# Altium schematic sheet PIC32MZ.SchDoc
size B; SheetNumber: 2; SheetTotal: 6
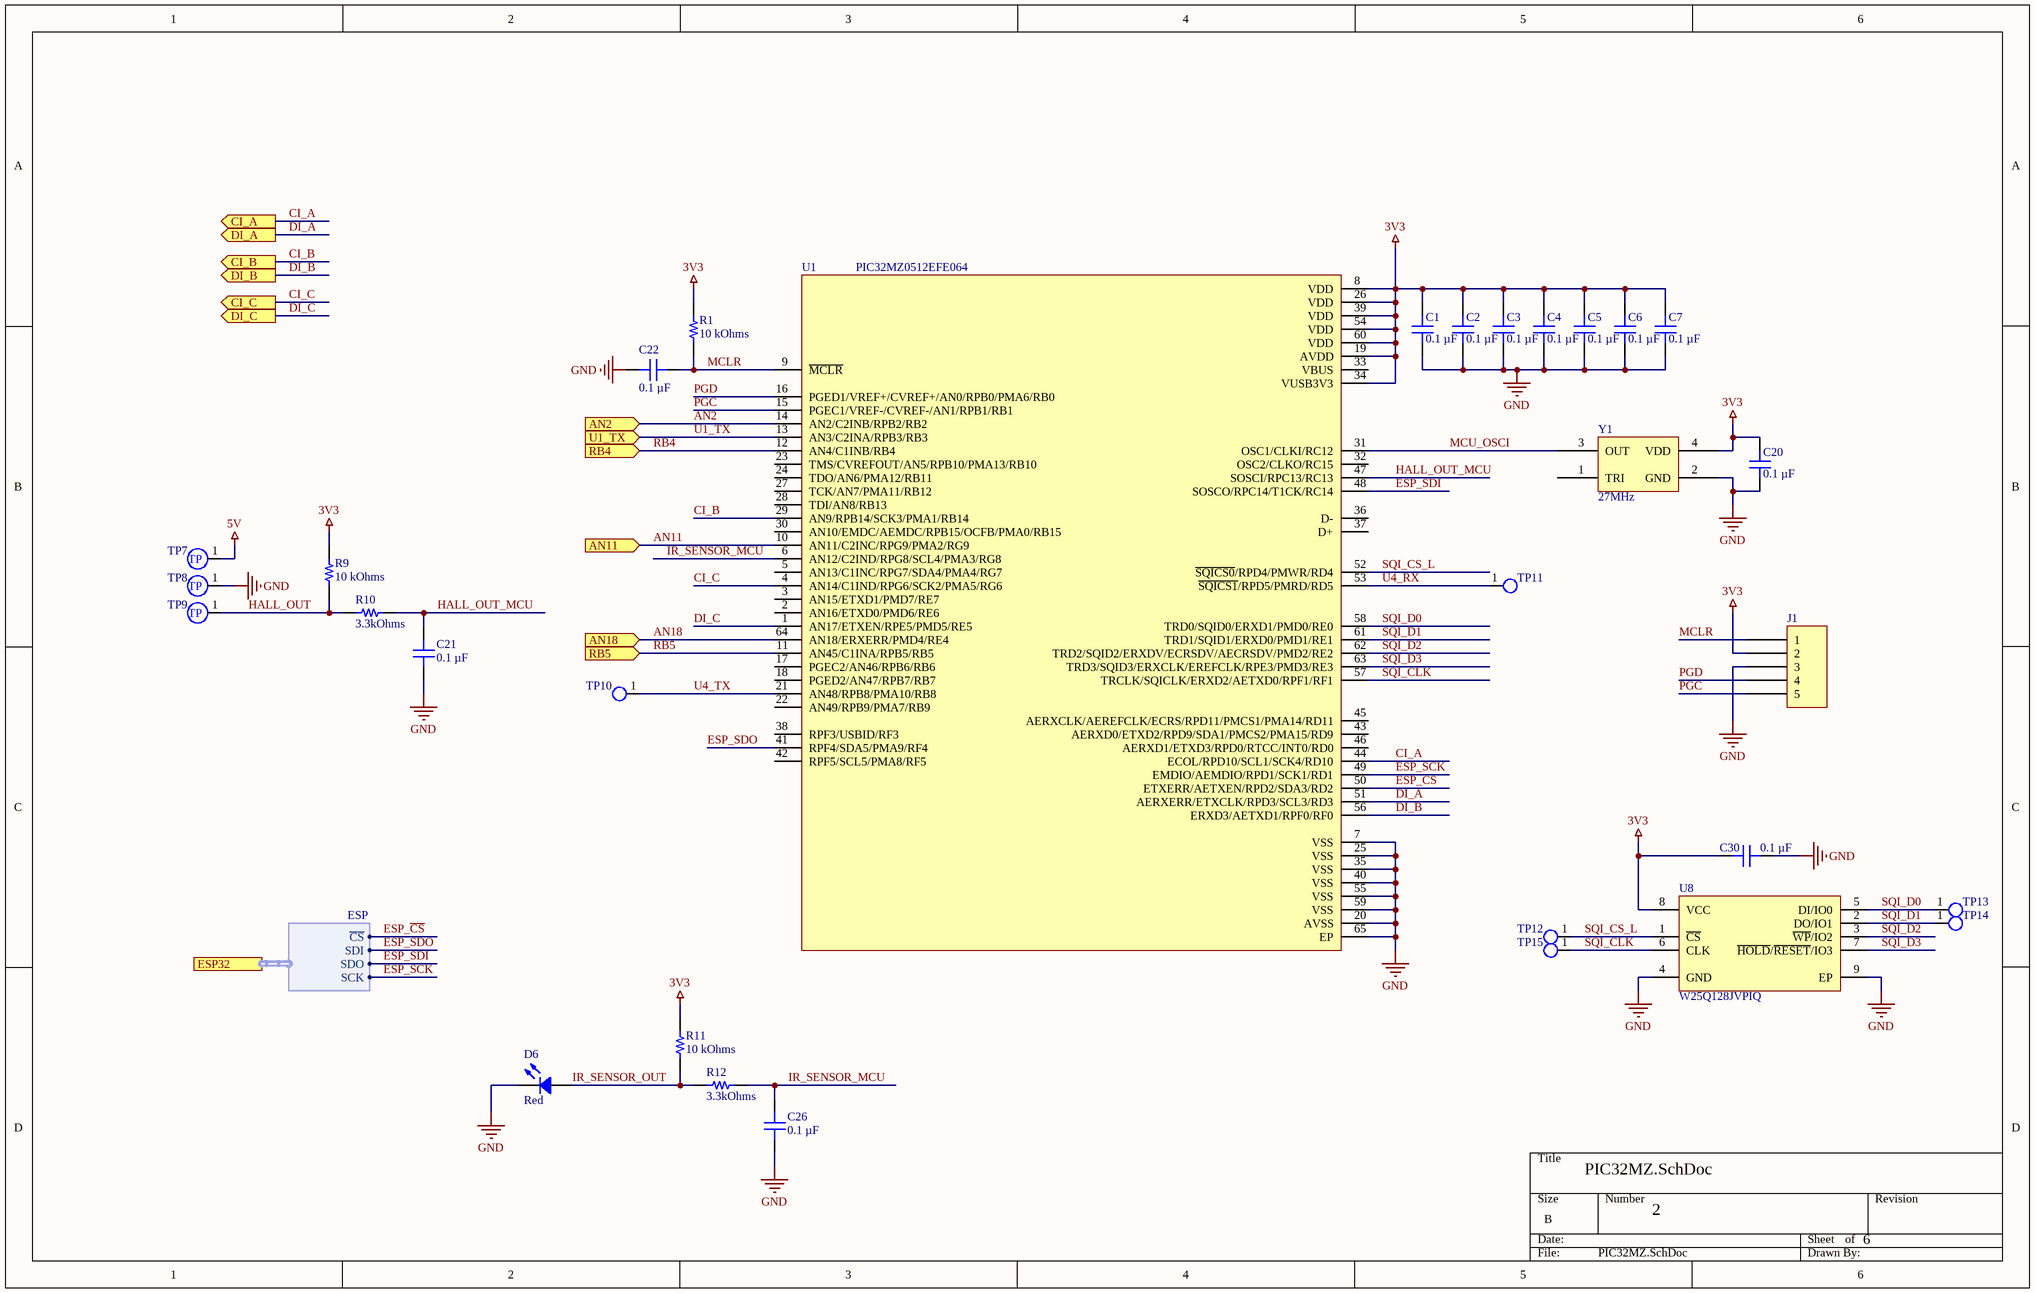
[diagram p0: PIC32MZ.SchDoc]

## Parts
C1  0.1 µF  [CAP 0402_1005]
C2  0.1 µF  [CAP 0402_1005]
C3  0.1 µF  [CAP 0402_1005]
C4  0.1 µF  [CAP 0402_1005]
C5  0.1 µF  [CAP 0402_1005]
C6  0.1 µF  [CAP 0402_1005]
C7  0.1 µF  [CAP 0402_1005]
C20  0.1 µF  [CAP 0402_1005]
C21  0.1 µF  [CAP 0402_1005]
C22  0.1 µF  [CAP 0402_1005]
C26  0.1 µF  [CAP 0402_1005]
C30  0.1 µF  [CAP 0402_1005]
D6  Red  [LED 0603_1608 RED]
J1  SM05B-SRSS-TB(LF)(SN)  [JST SM05B-SRSS-TB]  (value not drawn)
R1  10 kOhms  [RES 0402_1005]
R9  10 kOhms  [RES 0402_1005]
R10  3.3kOhms  [RES 0402_1005]
R11  10 kOhms  [RES 0402_1005]
R12  3.3kOhms  [RES 0402_1005]
TP7  TP  [TP]  (value not drawn)
TP8  TP  [TP]  (value not drawn)
TP9  TP  [TP]  (value not drawn)
TP10  0.8mm  [TP  0.8mm]  (value not drawn)
TP11  0.8mm  [TP  0.8mm]  (value not drawn)
TP12  0.8mm  [TP  0.8mm]  (value not drawn)
TP13  0.8mm  [TP  0.8mm]  (value not drawn)
TP14  0.8mm  [TP  0.8mm]  (value not drawn)
TP15  0.8mm  [TP  0.8mm]  (value not drawn)
U1  PIC32MZ0512EFE064  [QFN50P900X900X100-65N]
U8  W25Q128JVPIQ  [WSON-8 6x5 Winbond]
Y1  27MHz  [ABRACON ASD]

## Ports
AN2 (in), AN11 (in), AN18 (in), CI_A (out), CI_B (out), CI_C (out), DI_A (out), DI_B (out), DI_C (out), ESP32 (harness ESP), RB4 (in), RB5 (in), U1_TX (in)

## Harnesses
ESP: ~{CS}, SDI, SDO, SCK

## Nets
3V3: C1.2 C2.2 C3.2 C4.2 C5.2 C6.2 C7.2 C20.2 C30.2 J1.2 R1.2 R9.2 R11.2 U1.8(VDD) U1.19(AVDD) U1.26(VDD) U1.34(VUSB3V3) U1.39(VDD) U1.54(VDD) U1.60(VDD) U8.8(VCC) Y1.4(VDD)
5V: TP7.1(TP)
GND: C1.1 C2.1 C3.1 C4.1 C5.1 C6.1 C7.1 C20.1 C21.2 C22.1 C26.2 C30.1 D6.2 J1.3 TP8.1(TP) U1.7(VSS) U1.20(AVSS) U1.25(VSS) U1.35(VSS) U1.40(VSS) U1.55(VSS) U1.59(VSS) U1.65(EP) U8.4(GND) U8.9(EP) Y1.2(GND)
AN2: U1.14(AN2/C2INB/RPB2/RB2) ; port AN2
AN11: U1.10(AN11/C2INC/RPG9/PMA2/RG9) ; port AN11
AN18: U1.64(AN18/ERXERR/PMD4/RE4) ; port AN18
CI_A: U1.44(ECOL/RPD10/SCL1/SCK4/RD10) ; port CI_A
CI_B: U1.29(AN9/RPB14/SCK3/PMA1/RB14) ; port CI_B
CI_C: U1.4(AN14/C1IND/RPG6/SCK2/PMA5/RG6) ; port CI_C
DI_A: U1.51(AERXERR/ETXCLK/RPD3/SCL3/RD3) ; port DI_A
DI_B: U1.56(ERXD3/AETXD1/RPF0/RF0) ; port DI_B
DI_C: U1.1(AN17/ETXEN/RPE5/PMD5/RE5) ; port DI_C
ESP_~{CS}: U1.50(ETXERR/AETXEN/RPD2/SDA3/RD2) ; port ESP32.~{CS}
ESP_SCK: U1.49(EMDIO/AEMDIO/RPD1/SCK1/RD1) ; port ESP32.SCK
ESP_SDI: U1.48(SOSCO/RPC14/T1CK/RC14) ; port ESP32.SDO
ESP_SDO: U1.41(RPF4/SDA5/PMA9/RF4) ; port ESP32.SDI
HALL_OUT: R9.1 R10.2 TP9.1(TP)
HALL_OUT_MCU: C21.1 R10.1 U1.47(SOSCI/RPC13/RC13)
IR_SENSOR_MCU: C26.1 R12.1 U1.6(AN12/C2IND/RPG8/SCL4/PMA3/RG8)
IR_SENSOR_OUT: D6.1 R11.1 R12.2
MCLR: C22.2 J1.1 R1.1 U1.9(~{MCLR})
MCU_OSCI: U1.31(OSC1/CLKI/RC12) Y1.3(OUT)
PGC: J1.5 U1.15(PGEC1/VREF-/CVREF-/AN1/RPB1/RB1)
PGD: J1.4 U1.16(PGED1/VREF+/CVREF+/AN0/RPB0/PMA6/RB0)
RB4: U1.12(AN4/C1INB/RB4) ; port RB4
RB5: U1.11(AN45/C1INA/RPB5/RB5) ; port RB5
SQI_CLK: TP15.1(TP) U1.57(TRCLK/SQICLK/ERXD2/AETXD0/RPF1/RF1) U8.6(CLK)
SQI_CS_L: TP12.1(TP) U1.52(~{SQICS0}/RPD4/PMWR/RD4) U8.1(~{CS})
SQI_D0: TP13.1(TP) U1.58(TRD0/SQID0/ERXD1/PMD0/RE0) U8.5(DI/IO0)
SQI_D1: TP14.1(TP) U1.61(TRD1/SQID1/ERXD0/PMD1/RE1) U8.2(DO/IO1)
SQI_D2: U1.62(TRD2/SQID2/ERXDV/ECRSDV/AECRSDV/PMD2/RE2) U8.3(~{WP}/IO2)
SQI_D3: U1.63(TRD3/SQID3/ERXCLK/EREFCLK/RPE3/PMD3/RE3) U8.7(~{HOLD}/~{RESET}/IO3)
U1_TX: U1.13(AN3/C2INA/RPB3/RB3) ; port U1_TX
U4_RX: TP11.1(TP) U1.53(~{SQICS1}/RPD5/PMRD/RD5)
U4_TX: TP10.1(TP) U1.21(AN48/RPB8/PMA10/RB8)

Not connected (* = marked no-connect by the designer): U1 2(AN16/ETXD0/PMD6/RE6) 3(AN15/ETXD1/PMD7/RE7) 5(AN13/C1INC/RPG7/SDA4/PMA4/RG7) 17(PGEC2/AN46/RPB6/RB6) 18(PGED2/AN47/RPB7/RB7) 22(AN49/RPB9/PMA7/RB9) 23(TMS/CVREFOUT/AN5/RPB10/PMA13/RB10) 24(TDO/AN6/PMA12/RB11) 27(TCK/AN7/PMA11/RB12) 28(TDI/AN8/RB13) 30(AN10/EMDC/AEMDC/RPB15/OCFB/PMA0/RB15) 32(OSC2/CLKO/RC15) 33(VBUS) 36(D-) 37(D+) 38(RPF3/USBID/RF3) 42(RPF5/SCL5/PMA8/RF5) 43(AERXD0/ETXD2/RPD9/SDA1/PMCS2/PMA15/RD9) 45(AERXCLK/AEREFCLK/ECRS/RPD11/PMCS1/PMA14/RD11) 46(AERXD1/ETXD3/RPD0/RTCC/INT0/RD0); Y1 1(TRI)

## Library data of the parts
C1-C7 C21 C22 C26 C30 = C1005X5R1E104K050BC: CAP CER 0.1UF 25V X5R 0402; manufacturer: TDK Corporation; Tolerance: ±10%; Part Number: C1005X5R1E104K050BC; Value: 0.1 µF; Applications: General Purpose; Capacitance: 0.1 µF; componentlink1description: Datasheet; componentlink1url: https://product.tdk.com/info/en/catalog/datasheets/mlcc_commercial_general_en.pdf?ref_disty=digikey; componentlink2description: DigiKey Link; componentlink2url: https://www.digikey.com/en/products/detail/tdk-corporation/C1005X5R1E104K050BC/2093232; Device Package: 0402 (1005 Metric); Features: Low ESL; lastupdated: 9/24/2023 7:03:59 PM; Lifecycle Status: Active; Minimum Order: 1; Mounting Type: Surface Mount, MLCC; Operating Temperature: -55°C ~ 85°C; Package / Case: 0402 (1005 Metric); packaging: TapeAndReel; partid: 34396; Part Status: Active; price: 0.01; series: C; Size / Dimension: 0.039" L x 0.020" W (1.00mm x 0.50mm); Supplier 1: DigiKey; Supplier Part Number 1: 445-4964-1-ND; Temperature Coefficient: X5R; Thickness (Max): 0.022" (0.55mm); Voltage - Rated: 25V
C20 = C0402C104K4RACAUTO: CAP CER 0.1UF 16V X7R 0402; manufacturer: KEMET; Tolerance: ±10%; Part Number: C0402C104K4RACAUTO; Value: 0.1 µF; Applications: Automotive, Bypass, Decoupling; Capacitance: 0.1 µF; componentlink1description: Datasheet; componentlink1url: https://api.kemet.com/component-edge/download/specsheet/C0402C104K4RACAUTO.pdf; componentlink2description: DigiKey Link; componentlink2url: https://www.digikey.com/en/products/detail/kemet/C0402C104K4RACAUTO/3314827; Device Package: 0402 (1005 Metric); lastupdated: 8/14/2022 9:05:51 PM; Lifecycle Status: Active; Minimum Order: 1; Mounting Type: Surface Mount, MLCC; Operating Temperature: -55°C ~ 125°C; Package / Case: 0402 (1005 Metric); packaging: TapeAndReel; partid: 3024; Part Status: Active; price: 0.01; Ratings: AEC-Q200; series: SMD Auto X7R; Size / Dimension: 0.039" L x 0.020" W (1.00mm x 0.50mm); Supplier 1: DigiKey; Supplier Part Number 1: 399-6828-1-ND; Temperature Coefficient: X7R; Thickness (Max): 0.022" (0.55mm); Voltage - Rated: 16V
D6 = 5988010107F: LED RED CLEAR 0603 SMD; Manufacturer: Dialight; Configuration: Standard; Current - Test: 20mA; Lens Color: Colorless; Lens Size: 1.10mm x 0.80mm; Lens Style: Rectangle with Flat Top; Millicandela Rating: 60mcd; Viewing Angle: 140°; Voltage - Forward (Vf) (Typ): 2V; Wavelength - Dominant: 635nm; Part Number: 5988010107F; Color: Red; ComponentLink1Description: Datasheet; ComponentLink1URL: //media.digikey.com/pdf/Data%20Sheets/Dialight%20PDFs/598_Series_0603_Pkg.pdf; ComponentLink2Description: DigiKey Link; ComponentLink2URL: https://www.digikey.com/en/products/detail/dialight/5988010107F/1291263; Device Package: 0603 (1608 Metric); Height (Max): 0.70mm; LastUpdated: 9/30/2023 8:22:05 PM; Lens Transparency: Clear; Lifecycle Status: Active; Minimum Order: 1; Mounting Type: Surface Mount; Package / Case: 0603 (1608 Metric); Packaging: TapeAndReel; PartId: 460; Part Status: Active; Price: 0.05; Series: 598; Size / Dimension: 1.60mm L x 0.80mm W; Supplier 1: DigiKey; Supplier Part Number 1: 350-2029-1-ND; Supplier Device Package: 0603; Value: Red
J1 = SM05B-SRSS-TB(LF)(SN): CONN HEADER SMD R/A 5POS 1MM; Manufacturer: JST Sales America Inc.; Current Rating (Amps): 0.7A; Material Flammability Rating: UL94 V-0; Number of Positions: 5; Number of Positions Loaded: All; Pitch - Mating: 0.039" (1.00mm); Shrouding: Shrouded - 4 Wall; Style: Board to Cable/Wire; Voltage Rating: 50V; Part Number: SM05B-SRSS-TB(LF)(SN); ComponentLink1Description: Datasheet; ComponentLink1URL: http://www.jst-mfg.com/product/pdf/eng/eSH.pdf; ComponentLink2Description: DigiKey Link; ComponentLink2URL: http://digikey.com/product-detail/en/jst-sales-america-inc/SM05B-SRSS-TB-LF-SN/455-1805-1-ND/926876; Connector Type: Header; Contact Finish - Mating: Tin; Contact Finish - Post: Tin; Contact Material: Copper Alloy; Contact Shape: Square; Contact Type: Male Pin; Fastening Type: Push-Pull; Features: Solder Retention; Insulation Color: Natural; Insulation Height: 0.114" (2.90mm); Insulation Material: Polyamide (PA), Nylon; LastUpdated: 1/12/2020 11:42:04 PM; Lifecycle Status: Active; Minimum Order: 1; Mounting Type: Surface Mount, Right Angle; Number of Rows: 1; Operating Temperature: -25°C ~ 85°C; Packaging: TapeAndReel; PartId: 63; Part Status: Active; Price: 0.32; Series: SR; Supplier 1: DigiKey; Supplier Part Number 1: 455-1805-1-ND; Termination: Solder
R1 R9 R11 = CRCW040210K0DHEDP: RES SMD 10K OHM 0.5% 1/16W 0402; Manufacturer: Vishay Dale; Power (Watts): 0.063W, 1/16W; Temperature Coefficient: ±50ppm/°C; Part Number: CRCW040210K0DHEDP; Value: 10 kOhms; ComponentLink1Description: Datasheet; ComponentLink1URL: http://www.vishay.com/docs/20036/dcrcwpe3.pdf; ComponentLink2Description: DigiKey Link; ComponentLink2URL: https://www.digikey.com/en/products/detail/vishay-dale/CRCW040210K0DHEDP/3593893; Composition: Thick Film; Device Package: 0402 (1005 Metric); Features: Automotive AEC-Q200; Height - Seated (Max): 0.016" (0.40mm); LastUpdated: 9/24/2023 7:25:38 PM; Lifecycle Status: Active; Minimum Order: 1; Number of Terminations: 2; Operating Temperature: -55°C ~ 155°C; Package / Case: 0402 (1005 Metric); Packaging: TapeAndReel; PartId: 5057; Part Status: Active; Price: 0.03; Ratings: AEC-Q200; Resistance: 10 kOhms; Series: CRCW-P; Size / Dimension: 0.039" L x 0.020" W (1.00mm x 0.50mm); Supplier 1: DigiKey; Supplier Part Number 1: 541-10KAVCT-ND; Supplier Device Package: 0402; Tolerance: ±0.5%
R10 R12 = CRCW040210K0DHEDP: RES SMD 10K OHM 0.5% 1/16W 0402; Manufacturer: Vishay Dale; Power (Watts): 0.063W, 1/16W; Resistance: 10 kOhms; Temperature Coefficient: ±50ppm/°C; Part Number: CRCW040210K0DHEDP; Value: 3.3kOhms; ComponentLink1Description: Datasheet; ComponentLink1URL: http://www.vishay.com/docs/20036/dcrcwpe3.pdf; ComponentLink2Description: DigiKey Link; ComponentLink2URL: https://www.digikey.com/en/products/detail/vishay-dale/CRCW040210K0DHEDP/3593893; Composition: Thick Film; Device Package: 0402 (1005 Metric); Features: Automotive AEC-Q200; Height - Seated (Max): 0.016" (0.40mm); LastUpdated: 9/24/2023 7:25:38 PM; Lifecycle Status: Active; Minimum Order: 1; Number of Terminations: 2; Operating Temperature: -55°C ~ 155°C; Package / Case: 0402 (1005 Metric); Packaging: TapeAndReel; PartId: 5057; Part Status: Active; Price: 0.03; Ratings: AEC-Q200; Series: CRCW-P; Size / Dimension: 0.039" L x 0.020" W (1.00mm x 0.50mm); Supplier 1: DigiKey; Supplier Part Number 1: 541-10KAVCT-ND; Supplier Device Package: 0402; Tolerance: ±0.5%
TP7-TP9 = TP: Test point
TP10-TP15 = TP 0.8mm: Test point
U1 = PIC32MZ0512EFE064-I/PT: 32-bit Microcontrollers - MCU 32-BIT MCU 512KB FL 128KB RAM, No Crypto; MF: Microchip; MP: PIC32MZ2048EFG064T-I/PT; Price: None; Value: *; SnapEDA_Link: https://www.snapeda.com/parts/PIC32MZ2048EFG064T-I/PT/Microchip/view-part/565997/?ref=snap; Package: TQFP-64 Microchip; Availability: Unavailable
U8 = W25Q128JVPIQ: Quad SPI FLASH 16MB
Y1 = ASD3-27.000MHZ-EC-T: XTAL OSC XO 27.0000MHZ HCMOS SMD; Manufacturer: Abracon LLC; Base Resonator: Crystal; Current - Supply (Max): 4mA; Frequency Stability: ±50ppm; Function: Enable/Disable; Voltage - Supply: 1.8V; Part Number: ASD3-27.000MHZ-EC-T; ComponentLink1Description: Datasheet; ComponentLink1URL: https://abracon.com/Oscillators/ASDseries.pdf; ComponentLink2Description: DigiKey Link; ComponentLink2URL: http://digikey.com/product-detail/en/abracon-llc/ASD3-27.000MHZ-EC-T/535-9608-1-ND/1237075; Frequency: 27MHz; Height - Seated (Max): 0.039" (1.00mm); LastUpdated: 9/14/2022 8:37:45 AM; Lifecycle Status: Active; Minimum Order: 1; Mounting Type: Surface Mount; Operating Temperature: -20°C ~ 70°C; Output: HCMOS; Package / Case: 4-SMD, No Lead; Packaging: TapeAndReel; PartId: 4; Part Status: Active; Price: 1.74; Series: ASD; Size / Dimension: 0.098" L x 0.079" W (2.50mm x 2.00mm); Supplier 1: DigiKey; Supplier Part Number 1: 535-9608-1-ND; Type: XO (Standard); Value: 27MHz